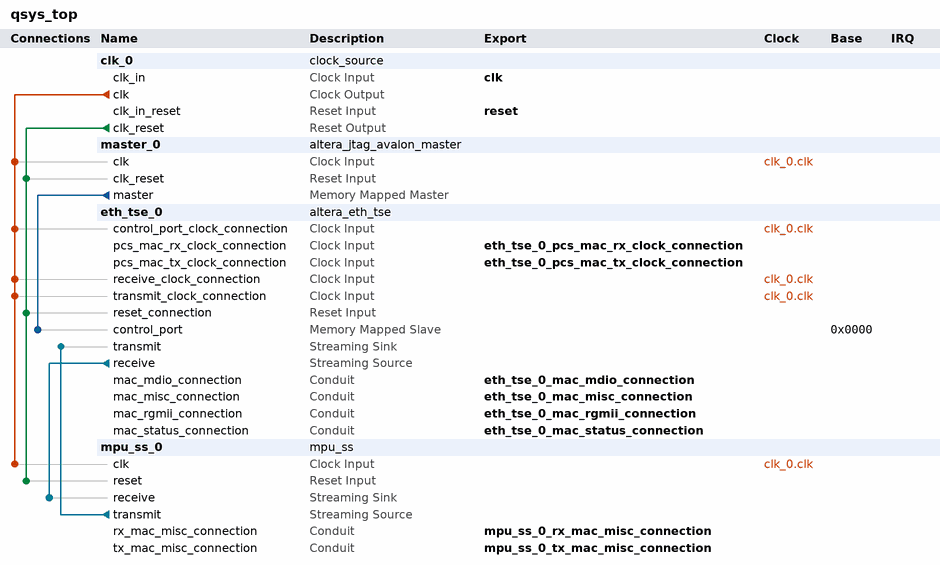
[diagram p0: system contents]
# Platform Designer (Qsys) system qsys_top, Cyclone 10 LP 10CL025YU256I7G
# Parameters at their usual value, and those the tool derives, are not listed.
package require -exact qsys 18.1
create_system qsys_top
set_project_property DEVICE_FAMILY {Cyclone 10 LP}
set_project_property DEVICE 10CL025YU256I7G

add_instance clk_0 clock_source 18.1
set_instance_parameter_value clk_0 clockFrequency 12500000

add_instance master_0 altera_jtag_avalon_master 18.1

add_instance eth_tse_0 altera_eth_tse 18.1
set_instance_parameter_value eth_tse_0 XCVR_RCFG_JTAG_ENABLE 0
set_instance_parameter_value eth_tse_0 XCVR_SET_CAPABILITY_REG_ENABLE 0
set_instance_parameter_value eth_tse_0 XCVR_SET_CSR_SOFT_LOGIC_ENABLE 0
set_instance_parameter_value eth_tse_0 XCVR_SET_PRBS_SOFT_LOGIC_ENABLE 0
set_instance_parameter_value eth_tse_0 XCVR_SET_USER_IDENTIFIER 0
set_instance_parameter_value eth_tse_0 core_variation MAC_ONLY
set_instance_parameter_value eth_tse_0 eg_addr 7
set_instance_parameter_value eth_tse_0 enable_hd_logic true
set_instance_parameter_value eth_tse_0 enable_mac_flow_ctrl true
set_instance_parameter_value eth_tse_0 enable_magic_detect false
set_instance_parameter_value eth_tse_0 enable_shift16 false
set_instance_parameter_value eth_tse_0 ifGMII RGMII
set_instance_parameter_value eth_tse_0 ing_addr 7
set_instance_parameter_value eth_tse_0 mdio_clk_div 50
set_instance_parameter_value eth_tse_0 stat_cnt_ena true
set_instance_parameter_value eth_tse_0 transceiver_type NONE

add_instance mpu_ss_0 mpu_ss 1.0

# connections
add_connection clk_0.clk eth_tse_0.control_port_clock_connection clock
add_connection clk_0.clk eth_tse_0.receive_clock_connection clock
add_connection clk_0.clk eth_tse_0.transmit_clock_connection clock
add_connection clk_0.clk master_0.clk clock
add_connection clk_0.clk mpu_ss_0.clk clock
add_connection clk_0.clk_reset eth_tse_0.reset_connection reset
add_connection clk_0.clk_reset master_0.clk_reset reset
add_connection clk_0.clk_reset mpu_ss_0.reset reset
add_connection master_0.master eth_tse_0.control_port avalon
set_connection_parameter_value master_0.master/eth_tse_0.control_port baseAddress 0x0000
add_connection eth_tse_0.receive mpu_ss_0.receive avalon_streaming
add_connection mpu_ss_0.transmit eth_tse_0.transmit avalon_streaming

# exported interfaces
add_interface clk clock sink
set_interface_property clk EXPORT_OF clk_0.clk_in
add_interface eth_tse_0_mac_mdio_connection conduit end
set_interface_property eth_tse_0_mac_mdio_connection EXPORT_OF eth_tse_0.mac_mdio_connection
add_interface eth_tse_0_mac_misc_connection conduit end
set_interface_property eth_tse_0_mac_misc_connection EXPORT_OF eth_tse_0.mac_misc_connection
add_interface eth_tse_0_mac_rgmii_connection conduit end
set_interface_property eth_tse_0_mac_rgmii_connection EXPORT_OF eth_tse_0.mac_rgmii_connection
add_interface eth_tse_0_mac_status_connection conduit end
set_interface_property eth_tse_0_mac_status_connection EXPORT_OF eth_tse_0.mac_status_connection
add_interface eth_tse_0_pcs_mac_rx_clock_connection clock sink
set_interface_property eth_tse_0_pcs_mac_rx_clock_connection EXPORT_OF eth_tse_0.pcs_mac_rx_clock_connection
add_interface eth_tse_0_pcs_mac_tx_clock_connection clock sink
set_interface_property eth_tse_0_pcs_mac_tx_clock_connection EXPORT_OF eth_tse_0.pcs_mac_tx_clock_connection
add_interface mpu_ss_0_rx_mac_misc_connection conduit end
set_interface_property mpu_ss_0_rx_mac_misc_connection EXPORT_OF mpu_ss_0.rx_mac_misc_connection
add_interface mpu_ss_0_tx_mac_misc_connection conduit end
set_interface_property mpu_ss_0_tx_mac_misc_connection EXPORT_OF mpu_ss_0.tx_mac_misc_connection
add_interface reset reset sink
set_interface_property reset EXPORT_OF clk_0.clk_in_reset

set_interconnect_requirement {$system} qsys_mm.clockCrossingAdapter AUTO
set_interconnect_requirement {$system} qsys_mm.enableEccProtection FALSE
set_interconnect_requirement {$system} qsys_mm.insertDefaultSlave FALSE
set_interconnect_requirement {$system} qsys_mm.maxAdditionalLatency 1

save_system qsys_top.qsys
